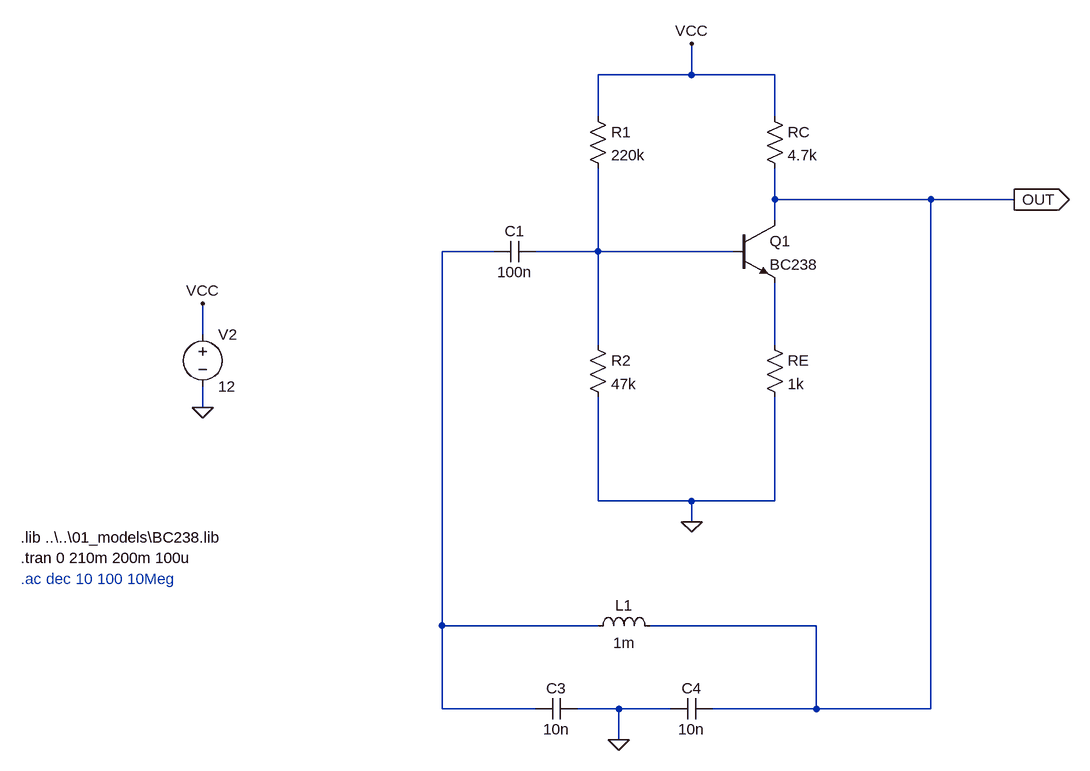
[diagram p0: schematic colpitts_osc.asc]
colpitts_osc.asc, the LTspice schematic file:
Version 4
SHEET 1 1156 932
WIRE 544 -112 544 -160
WIRE 544 -112 400 -112
WIRE 672 -112 544 -112
WIRE 400 -48 400 -112
WIRE 672 -48 672 -112
WIRE 672 80 672 32
WIRE 912 80 672 80
WIRE 1040 80 912 80
WIRE 672 112 672 80
WIRE 240 160 160 160
WIRE 400 160 400 32
WIRE 400 160 304 160
WIRE 608 160 400 160
WIRE -208 288 -208 240
WIRE 400 304 400 160
WIRE 672 304 672 208
WIRE -208 400 -208 368
WIRE 400 544 400 384
WIRE 544 544 400 544
WIRE 672 544 672 384
WIRE 672 544 544 544
WIRE 544 576 544 544
WIRE 160 736 160 160
WIRE 400 736 160 736
WIRE 736 736 480 736
WIRE 160 864 160 736
WIRE 304 864 160 864
WIRE 432 864 368 864
WIRE 512 864 432 864
WIRE 736 864 736 736
WIRE 736 864 576 864
WIRE 912 864 912 80
WIRE 912 864 736 864
WIRE 432 912 432 864
FLAG 544 576 0
FLAG -208 400 0
FLAG -208 240 VCC
FLAG 544 -160 VCC
FLAG 1040 80 OUT
IOPIN 1040 80 Out
FLAG 432 912 0
SYMBOL npn 608 112 R0
SYMATTR InstName Q1
SYMATTR Value BC238
SYMBOL res 656 -64 R0
SYMATTR InstName RC
SYMATTR Value 4.7k
SYMBOL res 656 288 R0
SYMATTR InstName RE
SYMATTR Value 1k
SYMBOL res 384 -64 R0
SYMATTR InstName R1
SYMATTR Value 220k
SYMBOL res 384 288 R0
SYMATTR InstName R2
SYMATTR Value 47k
SYMBOL cap 304 144 R90
WINDOW 0 0 32 VBottom 2
WINDOW 3 32 32 VTop 2
SYMATTR InstName C1
SYMATTR Value 100n
SYMBOL voltage -208 272 R0
WINDOW 123 0 0 Left 2
WINDOW 39 0 0 Left 2
SYMATTR InstName V2
SYMATTR Value 12
SYMBOL ind 384 752 R270
WINDOW 0 32 56 VTop 2
WINDOW 3 5 56 VBottom 2
SYMATTR InstName L1
SYMATTR Value 1m
SYMBOL cap 368 848 R90
WINDOW 0 0 32 VBottom 2
WINDOW 3 32 32 VTop 2
SYMATTR InstName C3
SYMATTR Value 10n
SYMBOL cap 576 848 R90
WINDOW 0 0 32 VBottom 2
WINDOW 3 32 32 VTop 2
SYMATTR InstName C4
SYMATTR Value 10n
TEXT -488 632 Left 2 !.tran 0 210m 200m 100u
TEXT -488 664 Left 2 ;.ac dec 10 100 10Meg
TEXT -488 600 Left 2 !.lib ..\\..\\01_models\\BC238.lib

The netlist it stands for:
* colpitts_osc.asc
Q1 OUT N002 N003 0 BC238
RC VCC OUT 4.7k
RE N003 0 1k
R1 VCC N002 220k
R2 N002 0 47k
C1 N002 N001 100n
V2 VCC 0 12
L1 N001 OUT 1m
C3 0 N001 10n
C4 OUT 0 10n
.model NPN NPN
.model PNP PNP
.lib standard.bjt
.tran 0 210m 200m 100u
* .ac dec 10 100 10Meg
.lib ..\..\01_models\BC238.lib
.backanno
.end